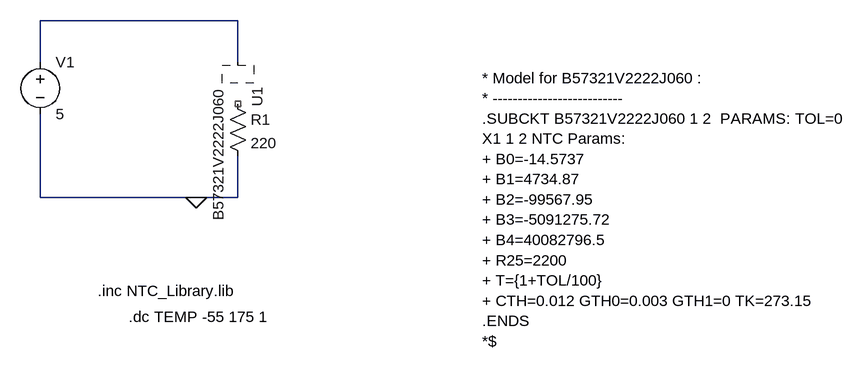
[diagram p0: schematic NTC_import.asc]
NTC_import.asc, the LTspice schematic file:
Version 4
SHEET 1 1272 680
WIRE -48 160 -352 160
WIRE -352 224 -352 160
WIRE -48 224 -48 160
WIRE -352 432 -352 304
WIRE -112 432 -352 432
WIRE -48 432 -48 368
WIRE -48 432 -112 432
FLAG -112 432 0
SYMBOL Voltage -352 208 R0
SYMATTR InstName V1
SYMATTR Value 5
SYMBOL Res -64 272 R0
SYMATTR InstName R1
SYMATTR Value 220
SYMBOL AutoGenerated/B57321V2222J060 -48 256 R90
SYMATTR InstName U1
SYMATTR SpiceLine TOL=0.01
TEXT -264 576 Left 2 !.inc NTC_Library.lib
TEXT 328 248 Left 2 !* Model for B57321V2222J060 : \n* --------------------------\n.SUBCKT B57321V2222J060 1 2  PARAMS: TOL=0\nX1 1 2 NTC Params: \n+ B0=-14.5737\n+ B1=4734.87\n+ B2=-99567.95\n+ B3=-5091275.72\n+ B4=40082796.5\n+ R25=2200\n+ T={1+TOL/100} \n+ CTH=0.012 GTH0=0.003 GTH1=0 TK=273.15 \n.ENDS \n*$
TEXT -216 616 Left 2 !.dc TEMP -55 175 1

The netlist it stands for:
* NTC_import.asc
V1 N001 0 5
R1 NC_01 0 220
* U1: B57321V2222J060 TOL=0.01 (symbol AutoGenerated/B57321V2222J060 not available, pin order unknown); nets seen at it: N001
.inc NTC_Library.lib
* Model for B57321V2222J060 :
* --------------------------
.SUBCKT B57321V2222J060 1 2  PARAMS: TOL=0
X1 1 2 NTC Params:
+ B0=-14.5737
+ B1=4734.87
+ B2=-99567.95
+ B3=-5091275.72
+ B4=40082796.5
+ R25=2200
+ T={1+TOL/100}
+ CTH=0.012 GTH0=0.003 GTH1=0 TK=273.15
.ENDS
*$
.dc TEMP -55 175 1
.backanno
.end